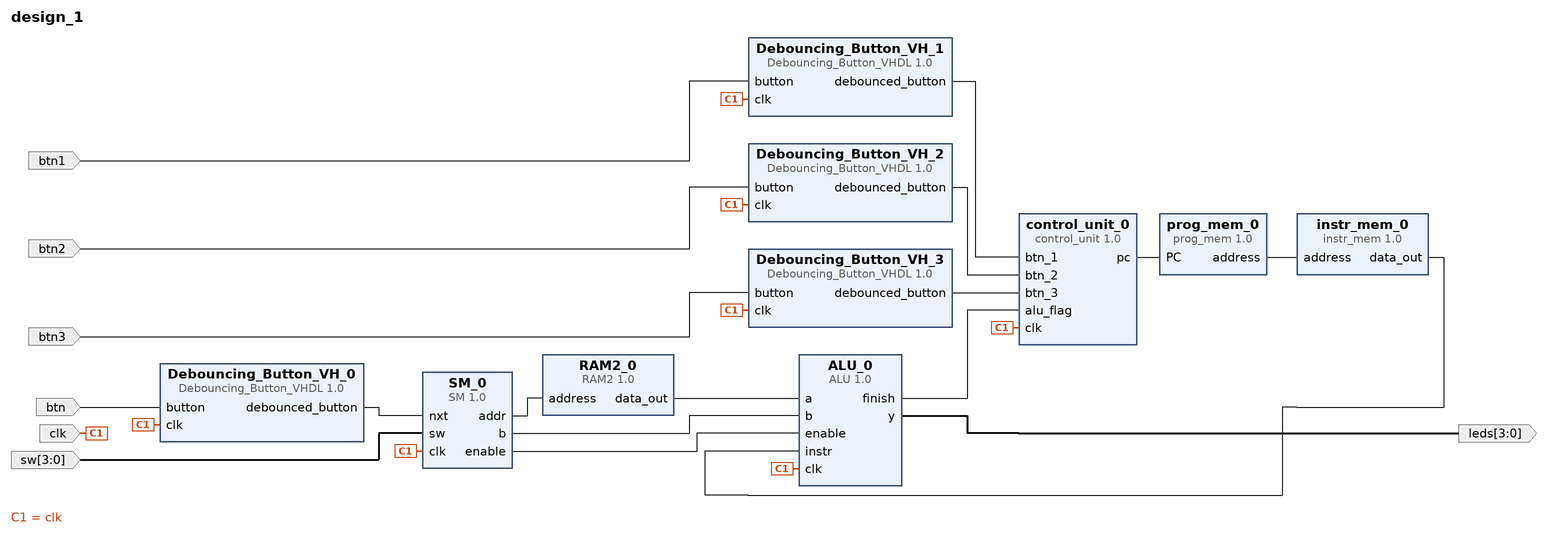
[diagram p0: block diagram of the top level]
# Vivado block design design_1, xc7z010clg400-1, Vivado 2020.1
create_bd_design design_1

create_bd_port -dir I -type clk clk
create_bd_port -dir O -from 3 -to 0 leds
create_bd_port -dir I btn
create_bd_port -dir I -from 3 -to 0 sw
create_bd_port -dir I btn1
create_bd_port -dir I btn2
create_bd_port -dir I btn3

create_bd_cell -type ip -vlnv xilinx.com:user:instr_mem:1.0 instr_mem_0
create_bd_cell -type ip -vlnv xilinx.com:user:RAM2:1.0 RAM2_0
create_bd_cell -type ip -vlnv xilinx.com:user:SM:1.0 SM_0
create_bd_cell -type ip -vlnv xilinx.com:user:Debouncing_Button_VHDL:1.0 Debouncing_Button_VH_0
create_bd_cell -type ip -vlnv xilinx.com:user:ALU:1.0 ALU_0
create_bd_cell -type ip -vlnv xilinx.com:user:Debouncing_Button_VHDL:1.0 Debouncing_Button_VH_1
create_bd_cell -type ip -vlnv xilinx.com:user:Debouncing_Button_VHDL:1.0 Debouncing_Button_VH_2
create_bd_cell -type ip -vlnv xilinx.com:user:Debouncing_Button_VHDL:1.0 Debouncing_Button_VH_3
create_bd_cell -type ip -vlnv xilinx.com:user:prog_mem:1.0 prog_mem_0
create_bd_cell -type ip -vlnv xilinx.com:user:control_unit:1.0 control_unit_0

# ---- connections ----

connect_bd_net [get_bd_pins RAM2_0/data_out] [get_bd_pins ALU_0/a]
connect_bd_net [get_bd_pins instr_mem_0/data_out] [get_bd_pins ALU_0/instr]
connect_bd_net -net clk_0_1 [get_bd_ports clk] \
  [get_bd_pins SM_0/clk] [get_bd_pins Debouncing_Button_VH_0/clk] [get_bd_pins ALU_0/clk] \
  [get_bd_pins Debouncing_Button_VH_1/clk] [get_bd_pins Debouncing_Button_VH_2/clk] [get_bd_pins Debouncing_Button_VH_3/clk] \
  [get_bd_pins control_unit_0/clk]
connect_bd_net [get_bd_pins ALU_0/y] [get_bd_ports leds]
connect_bd_net -net sw_0_1 [get_bd_ports sw] [get_bd_pins SM_0/sw]
connect_bd_net [get_bd_pins SM_0/addr] [get_bd_pins RAM2_0/address]
connect_bd_net [get_bd_pins SM_0/b] [get_bd_pins ALU_0/b]
connect_bd_net [get_bd_pins SM_0/enable] [get_bd_pins ALU_0/enable]
connect_bd_net [get_bd_ports btn] [get_bd_pins Debouncing_Button_VH_0/button]
connect_bd_net [get_bd_pins Debouncing_Button_VH_0/debounced_button] [get_bd_pins SM_0/nxt]
connect_bd_net [get_bd_pins ALU_0/finish] [get_bd_pins control_unit_0/alu_flag]
connect_bd_net -net btn1_1 [get_bd_ports btn1] [get_bd_pins Debouncing_Button_VH_1/button]
connect_bd_net [get_bd_pins Debouncing_Button_VH_1/debounced_button] [get_bd_pins control_unit_0/btn_1]
connect_bd_net -net btn2_1 [get_bd_ports btn2] [get_bd_pins Debouncing_Button_VH_2/button]
connect_bd_net [get_bd_pins Debouncing_Button_VH_2/debounced_button] [get_bd_pins control_unit_0/btn_2]
connect_bd_net -net btn3_1 [get_bd_ports btn3] [get_bd_pins Debouncing_Button_VH_3/button]
connect_bd_net [get_bd_pins Debouncing_Button_VH_3/debounced_button] [get_bd_pins control_unit_0/btn_3]
connect_bd_net [get_bd_pins control_unit_0/pc] [get_bd_pins prog_mem_0/PC]
connect_bd_net [get_bd_pins prog_mem_0/address] [get_bd_pins instr_mem_0/address]

validate_bd_design
save_bd_design
